# EAGLE schematic Schematico PCB (EAGLE 9.6.2)
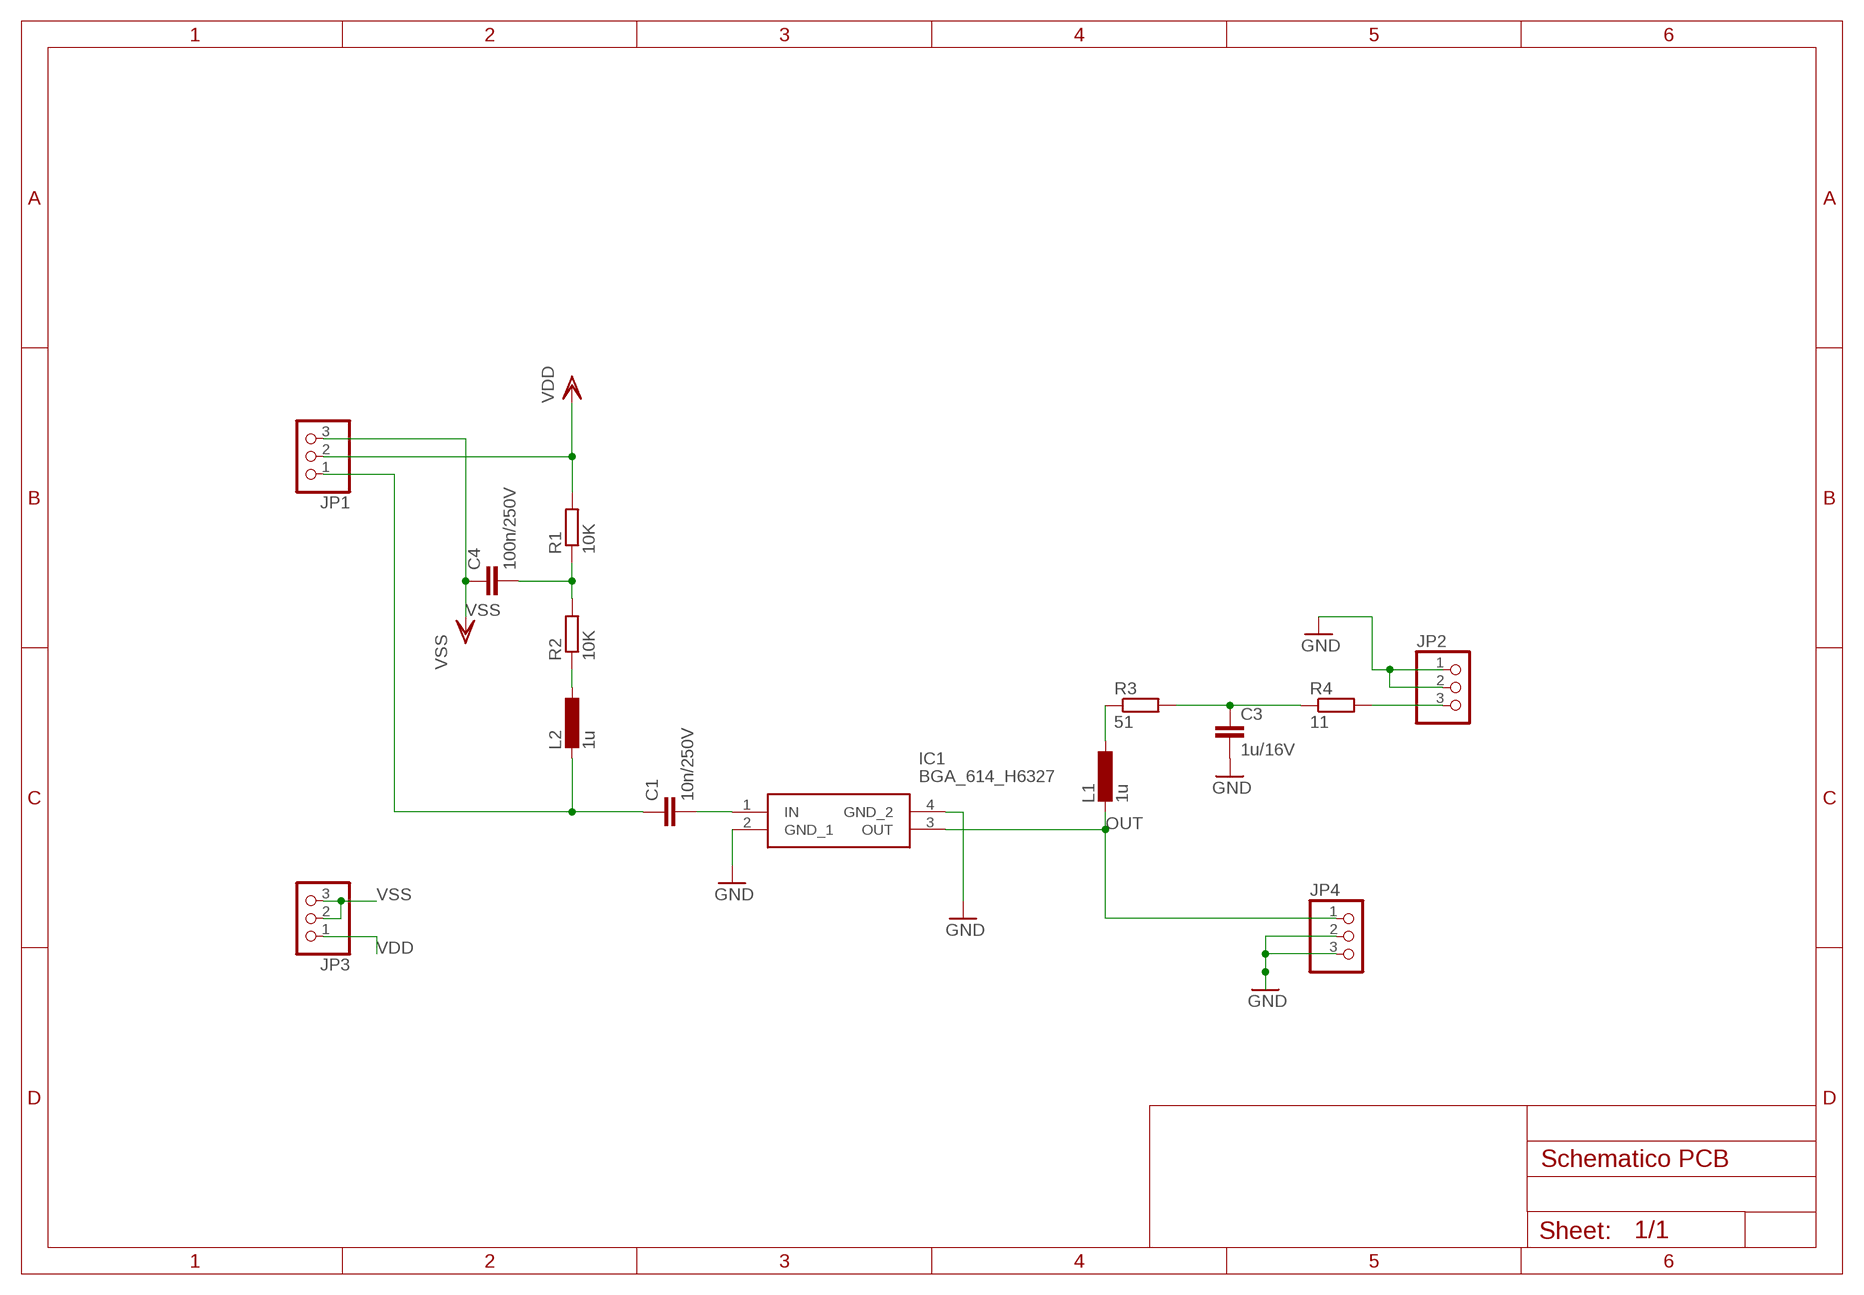
[diagram p0: schematic, sheet 1]

## Parts
C1  10n/250V  C-EUC0805  [C0805]
C3  1u/16V  C-EUC0805  [C0805]
C4  100n/250V  C-EUC0805  [C0805]
IC1  BGA_614_H6327  [BGA614H6327]
JP1  PINHD-1X3  [1X03]
JP2  PINHD-1X3  [1X03]
JP3  PINHD-1X3  [1X03]
JP4  PINHD-1X3  [1X03]
L1  1u  L-EUL1812  [L1812]
L2  1u  L-EUL1812  [L1812]
R1  10K  R-EU_R0805  [R0805]
R2  10K  R-EU_R0805  [R0805]
R3  51  R-EU_R0805  [R0805]
R4  11  R-EU_R0805  [R0805]

## Nets
GND: C3.2 IC1.2(GND_1) IC1.4(GND_2) JP2.1 JP2.2 JP4.2 JP4.3
N$1: C1.1 JP1.1 L2.2
N$2: L1.1 R3.1
N$4: JP2.3 R4.2
N$5: C1.2 IC1.1(IN)
N$6: C3.1 R3.2 R4.1
N$7: L2.1 R2.1
N$8: C4.2 R1.1 R2.2
OUT: IC1.3(OUT) JP4.1 L1.2
VDD: JP1.2 JP3.1 R1.2
VSS: C4.1 JP1.3 JP3.2 JP3.3

## Library data of the parts
C1 C3 C4 = rcl:C-EU: CAPACITOR, European symbol; SPICEPREFIX: C
IC1 = BGA_614_H6327:BGA_614_H6327: RF Amplifier RF SILICON MMIC Source: Datasheet <https://www.infineon.com/dgdl/Infineon-BGA614-DS-v02_01-en.pdf?fileId=db3a304314dca3890115418ffd35163a>; DESCRIPTION: RF Amplifier RF SILICON MMIC; HEIGHT: 1mm; MANUFACTURER_NAME: Infineon; MANUFACTURER_PART_NUMBER: BGA 614 H6327; MOUSER_PART_NUMBER: 726-BGA614H6327XT; MOUSER_PRICE-STOCK: https://www.mouser.co.uk/ProductDetail/Infineon-Technologies/BGA-614-H6327?qs=mzcOS1kGbgeELhUPKdvS0Q%3D%3D
JP1-JP4 = pinhead:PINHD-1X3: PIN HEADER
L1 L2 = rcl:L-EU: INDUCTOR, European symbol; SPICEPREFIX: L
R1-R4 = rcl:R-EU_: RESISTOR, European symbol; SPICEPREFIX: R